# EAGLE schematic u4xVCA_v3 (EAGLE 9.2.1)

## Sheet 1 of 5
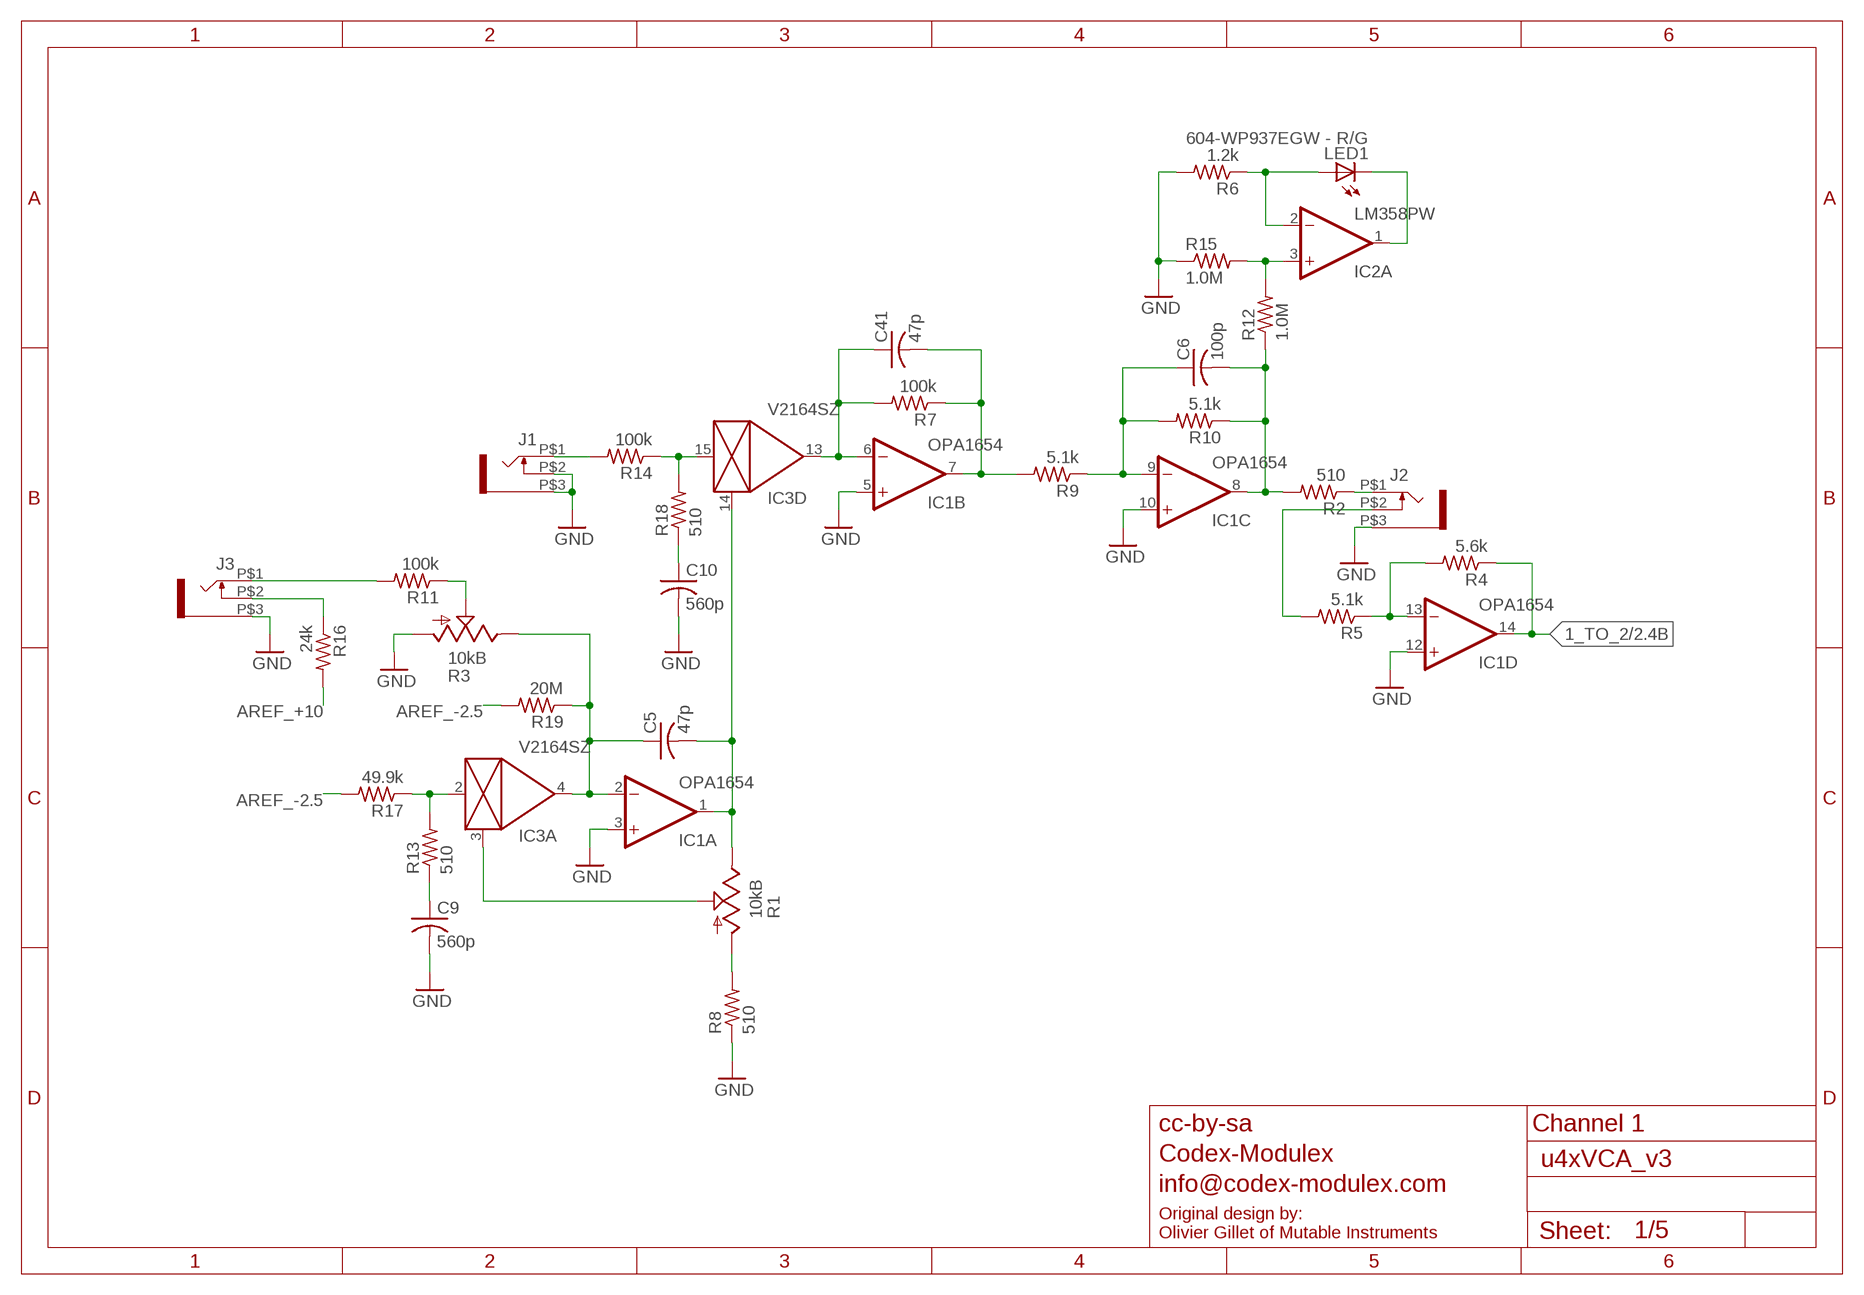
[diagram p0: schematic, sheet 1]

### Parts
C5  47p  C-USC0603  [C0603]
C6  100p  C-USC0603  [C0603]
C9  560p  C-USC0603  [C0603]
C10  560p  C-USC0603  [C0603]
C41  47p  C-USC0603  [C0603]
IC1  OPA1654  TL074PW  [TSSOP14]
IC2  LM358PW  TL072PW  [TSSOP8]
IC3  V2164SZ  SSM2164S  [SOIC16N]
J1  WQP-PJ301M-12_JACK  [WQP-PJ301M-12_JACK]
J2  WQP-PJ301M-12_JACK  [WQP-PJ301M-12_JACK]
J3  WQP-PJ301M-12_JACK  [WQP-PJ301M-12_JACK]
LED1  604-WP937EGW - R/G  LED3MM  [LED3MM]
R1  10kB  POT_USVERTICAL  [ALPS_POT_VERTICAL]
R2  510  PARTS_AMAN_RESISTOR  [PARTS_AMAN_RESISTOR_0603]
R3  10kB  POT_USVERTICAL  [ALPS_POT_VERTICAL]
R4  5.6k  PARTS_AMAN_RESISTOR  [PARTS_AMAN_RESISTOR_0603]
R5  5.1k  PARTS_AMAN_RESISTOR  [PARTS_AMAN_RESISTOR_0603]
R6  1.2k  PARTS_AMAN_RESISTOR  [PARTS_AMAN_RESISTOR_0603]
R7  100k  PARTS_AMAN_RESISTOR  [PARTS_AMAN_RESISTOR_0603]
R8  510  R-US_R0603  [R0603]
R9  5.1k  PARTS_AMAN_RESISTOR  [PARTS_AMAN_RESISTOR_0603]
R10  5.1k  PARTS_AMAN_RESISTOR  [PARTS_AMAN_RESISTOR_0603]
R11  100k  PARTS_AMAN_RESISTOR  [PARTS_AMAN_RESISTOR_0603]
R12  1.0M  PARTS_AMAN_RESISTOR  [PARTS_AMAN_RESISTOR_0603]
R13  510  PARTS_AMAN_RESISTOR  [PARTS_AMAN_RESISTOR_0603]
R14  100k  PARTS_AMAN_RESISTOR  [PARTS_AMAN_RESISTOR_0603]
R15  1.0M  PARTS_AMAN_RESISTOR  [PARTS_AMAN_RESISTOR_0603]
R16  24k  PARTS_AMAN_RESISTOR  [PARTS_AMAN_RESISTOR_0603]
R17  49.9k  PARTS_AMAN_RESISTOR  [PARTS_AMAN_RESISTOR_0603]
R18  510  PARTS_AMAN_RESISTOR  [PARTS_AMAN_RESISTOR_0603]
R19  20M  PARTS_AMAN_RESISTOR  [PARTS_AMAN_RESISTOR_0603]

### Nets
1_TO_2: IC1.14(D:OUT) R4.1 ; also sheet 2
AREF_+10: R16.2 ; also sheet 2,3,4,5
AREF_-2.5: R17.2 R19.2 ; also sheet 2,3,4,5
CV_IN_1: J3.P$1 R11.2
FOO: IC3.2(A:IN) R13.2 R17.1
GND: C9.2 C10.2 IC1.3(A:+IN) IC1.5(B:+IN) IC1.10(C:+IN) IC1.12(D:+IN) J1.P$2 J1.P$3 J2.P$3 J3.P$3 R3.P$3(A) R6.2 R8.1 R15.1 ; also sheet 2,3,4,5
N$1: IC2.3(A:+IN) R12.2 R15.2
N$7: J2.P$1 R2.1
N$9: IC3.3(A:CTRL) R1.P$2(S)
N$10: C6.1 IC1.9(C:-IN) R9.1 R10.2
N$14: R3.P$2(S) R11.1
N$15: R1.P$3(A) R8.2
N$18: IC2.1(A:OUT) LED1.K(C)
N$19: IC2.2(A:-IN) LED1.A R6.1
N$20: C9.1 R13.1
N$21: J3.P$2 R16.1
N$22: IC1.13(D:-IN) R4.2 R5.1
N$25: J2.P$2 R5.2
N$47: C10.1 R18.1
N$65: C5.1 IC1.2(A:-IN) IC3.4(A:OUT) R3.P$1(E) R19.1
N$66: J1.P$1 R14.2
N$75: IC3.15(D:IN) R14.1 R18.2
N$87: C5.2 IC1.1(A:OUT) IC3.14(D:CTRL) R1.P$1(E)
N$96: C41.1 IC1.6(B:-IN) IC3.13(D:OUT) R7.2
N$100: C41.2 IC1.7(B:OUT) R7.1 R9.2
OUT1: C6.2 IC1.8(C:OUT) R2.2 R10.1 R12.1

### Notes on the sheet
- cc-by-sa | Channel 1
- Codex-Modulex
- info@codex-modulex.com
- Original design by:
  Olivier Gillet of Mutable Instruments

## Sheet 2 of 5
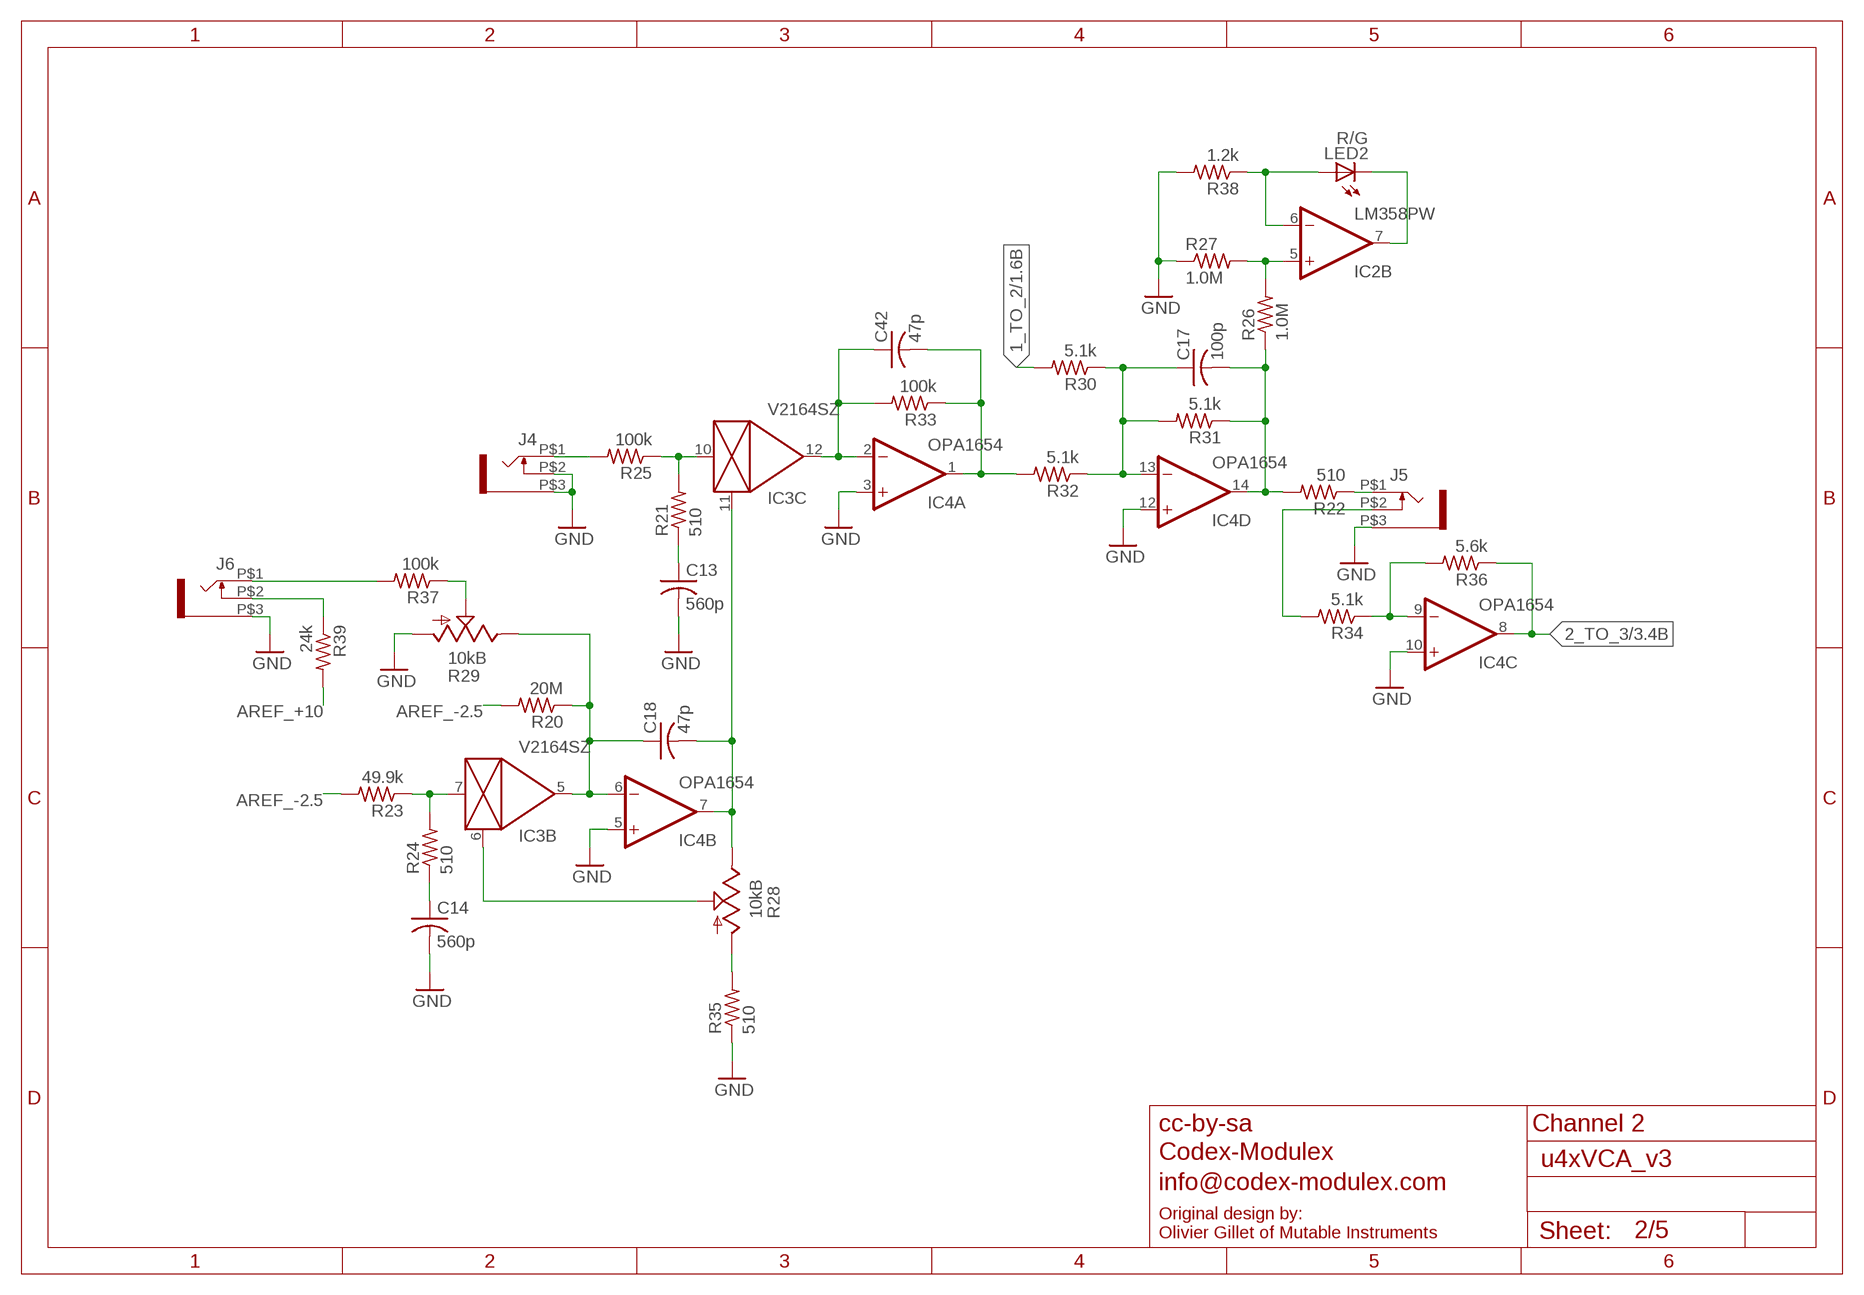
[diagram p1: schematic, sheet 2]

### Parts
C13  560p  C-USC0603  [C0603]
C14  560p  C-USC0603  [C0603]
C17  100p  C-USC0603  [C0603]
C18  47p  C-USC0603  [C0603]
C42  47p  C-USC0603  [C0603]
IC4  OPA1654  TL074PW  [TSSOP14]
J4  WQP-PJ301M-12_JACK  [WQP-PJ301M-12_JACK]
J5  WQP-PJ301M-12_JACK  [WQP-PJ301M-12_JACK]
J6  WQP-PJ301M-12_JACK  [WQP-PJ301M-12_JACK]
LED2  R/G  LED3MM  [LED3MM]
R20  20M  PARTS_AMAN_RESISTOR  [PARTS_AMAN_RESISTOR_0603]
R21  510  PARTS_AMAN_RESISTOR  [PARTS_AMAN_RESISTOR_0603]
R22  510  R-US_R0603  [R0603]
R23  49.9k  PARTS_AMAN_RESISTOR  [PARTS_AMAN_RESISTOR_0603]
R24  510  PARTS_AMAN_RESISTOR  [PARTS_AMAN_RESISTOR_0603]
R25  100k  PARTS_AMAN_RESISTOR  [PARTS_AMAN_RESISTOR_0603]
R26  1.0M  PARTS_AMAN_RESISTOR  [PARTS_AMAN_RESISTOR_0603]
R27  1.0M  PARTS_AMAN_RESISTOR  [PARTS_AMAN_RESISTOR_0603]
R28  10kB  POT_USVERTICAL  [ALPS_POT_VERTICAL]
R29  10kB  POT_USVERTICAL  [ALPS_POT_VERTICAL]
R30  5.1k  PARTS_AMAN_RESISTOR  [PARTS_AMAN_RESISTOR_0603]
R31  5.1k  PARTS_AMAN_RESISTOR  [PARTS_AMAN_RESISTOR_0603]
R32  5.1k  PARTS_AMAN_RESISTOR  [PARTS_AMAN_RESISTOR_0603]
R33  100k  PARTS_AMAN_RESISTOR  [PARTS_AMAN_RESISTOR_0603]
R34  5.1k  PARTS_AMAN_RESISTOR  [PARTS_AMAN_RESISTOR_0603]
R35  510  R-US_R0603  [R0603]
R36  5.6k  PARTS_AMAN_RESISTOR  [PARTS_AMAN_RESISTOR_0603]
R37  100k  PARTS_AMAN_RESISTOR  [PARTS_AMAN_RESISTOR_0603]
R38  1.2k  PARTS_AMAN_RESISTOR  [PARTS_AMAN_RESISTOR_0603]
R39  24k  PARTS_AMAN_RESISTOR  [PARTS_AMAN_RESISTOR_0603]

### Nets
1_TO_2: R30.2 ; also sheet 1
2_TO_3: IC4.8(C:OUT) R36.1 ; also sheet 3
AREF_+10: R39.2 ; also sheet 1,3,4,5
AREF_-2.5: R20.2 R23.2 ; also sheet 1,3,4,5
FOO1: IC3.7(B:IN) R23.1 R24.2
GND: C13.2 C14.2 IC4.3(A:+IN) IC4.5(B:+IN) IC4.10(C:+IN) IC4.12(D:+IN) J4.P$2 J4.P$3 J5.P$3 J6.P$3 R27.1 R29.P$3(A) R35.1 R38.2 ; also sheet 1,3,4,5
N$3: J4.P$1 R25.2
N$4: IC2.5(B:+IN) R26.2 R27.2
N$6: J5.P$1 R22.1
N$17: C13.1 R21.1
N$24: IC3.10(C:IN) R21.2 R25.1
N$26: IC3.6(B:CTRL) R28.P$2(S)
N$27: C17.1 IC4.13(D:-IN) R30.1 R31.2 R32.1
N$28: C18.2 IC3.11(C:CTRL) IC4.7(B:OUT) R28.P$1(E)
N$32: R28.P$3(A) R35.2
N$35: IC2.7(B:OUT) LED2.K(C)
N$36: IC2.6(B:-IN) LED2.A R38.1
N$37: IC4.9(C:-IN) R34.1 R36.2
N$38: J5.P$2 R34.2
N$39: C42.2 IC4.1(A:OUT) R32.2 R33.1
N$40: R29.P$2(S) R37.1
N$41: C14.1 R24.1
N$42: C18.1 IC3.5(B:OUT) IC4.6(B:-IN) R20.1 R29.P$1(E)
N$44: J6.P$1 R37.2
N$53: C42.1 IC3.12(C:OUT) IC4.2(A:-IN) R33.2
N$64: J6.P$2 R39.1
OUT2: C17.2 IC4.14(D:OUT) R22.2 R26.1 R31.1

### Notes on the sheet
- cc-by-sa | Channel 2
- Codex-Modulex
- info@codex-modulex.com
- Original design by:
  Olivier Gillet of Mutable Instruments

## Sheet 3 of 5
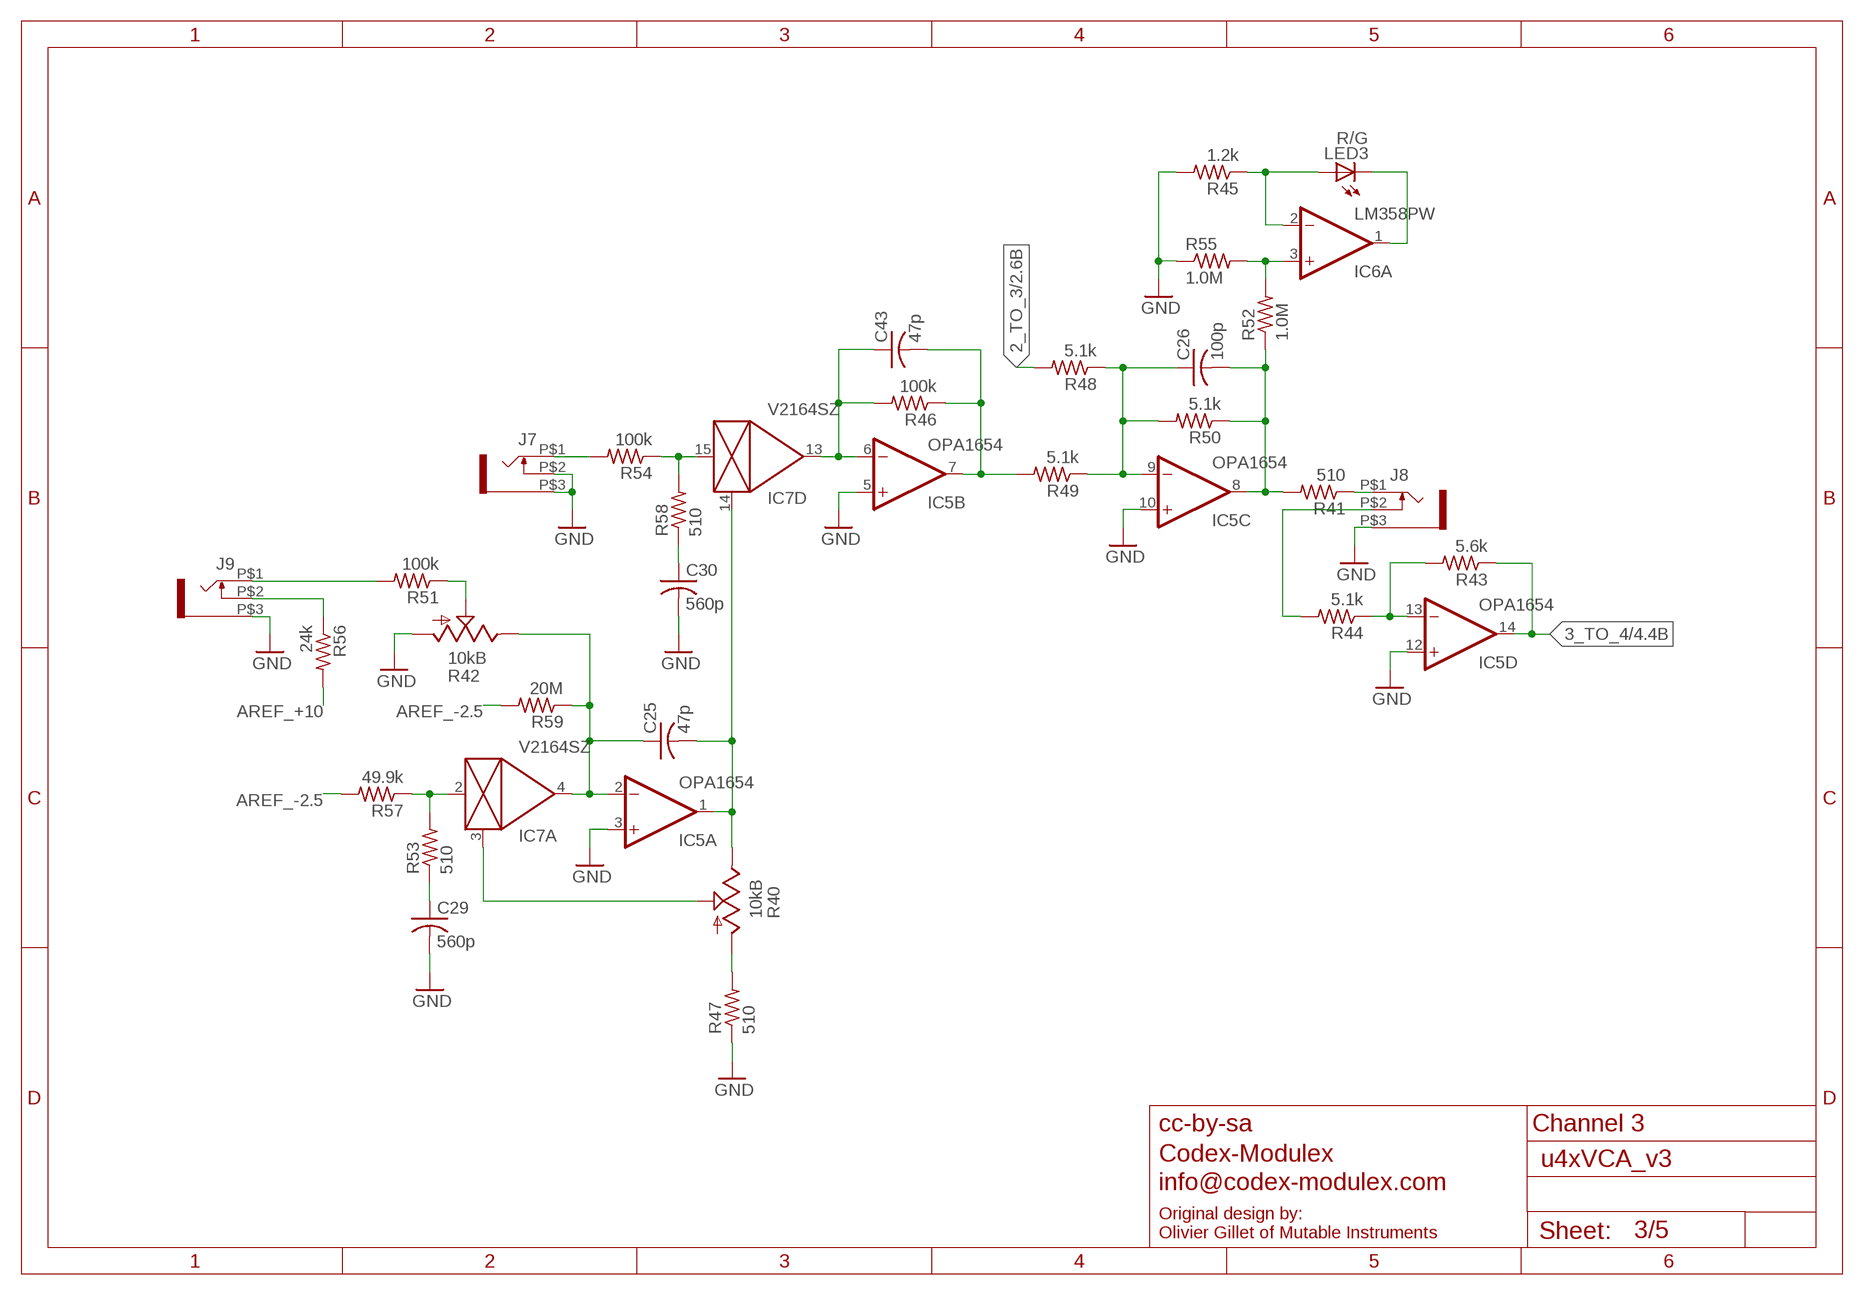
[diagram p2: schematic, sheet 3]

### Parts
C25  47p  C-USC0603  [C0603]
C26  100p  C-USC0603  [C0603]
C29  560p  C-USC0603  [C0603]
C30  560p  C-USC0603  [C0603]
C43  47p  C-USC0603  [C0603]
IC5  OPA1654  TL074PW  [TSSOP14]
IC6  LM358PW  TL072PW  [TSSOP8]
IC7  V2164SZ  SSM2164S  [SOIC16N]
J7  WQP-PJ301M-12_JACK  [WQP-PJ301M-12_JACK]
J8  WQP-PJ301M-12_JACK  [WQP-PJ301M-12_JACK]
J9  WQP-PJ301M-12_JACK  [WQP-PJ301M-12_JACK]
LED3  R/G  LED3MM  [LED3MM]
R40  10kB  POT_USVERTICAL  [ALPS_POT_VERTICAL]
R41  510  PARTS_AMAN_RESISTOR  [PARTS_AMAN_RESISTOR_0603]
R42  10kB  POT_USVERTICAL  [ALPS_POT_VERTICAL]
R43  5.6k  PARTS_AMAN_RESISTOR  [PARTS_AMAN_RESISTOR_0603]
R44  5.1k  PARTS_AMAN_RESISTOR  [PARTS_AMAN_RESISTOR_0603]
R45  1.2k  PARTS_AMAN_RESISTOR  [PARTS_AMAN_RESISTOR_0603]
R46  100k  PARTS_AMAN_RESISTOR  [PARTS_AMAN_RESISTOR_0603]
R47  510  PARTS_AMAN_RESISTOR  [PARTS_AMAN_RESISTOR_0603]
R48  5.1k  PARTS_AMAN_RESISTOR  [PARTS_AMAN_RESISTOR_0603]
R49  5.1k  PARTS_AMAN_RESISTOR  [PARTS_AMAN_RESISTOR_0603]
R50  5.1k  PARTS_AMAN_RESISTOR  [PARTS_AMAN_RESISTOR_0603]
R51  100k  PARTS_AMAN_RESISTOR  [PARTS_AMAN_RESISTOR_0603]
R52  1.0M  PARTS_AMAN_RESISTOR  [PARTS_AMAN_RESISTOR_0603]
R53  510  PARTS_AMAN_RESISTOR  [PARTS_AMAN_RESISTOR_0603]
R54  100k  PARTS_AMAN_RESISTOR  [PARTS_AMAN_RESISTOR_0603]
R55  1.0M  PARTS_AMAN_RESISTOR  [PARTS_AMAN_RESISTOR_0603]
R56  24k  PARTS_AMAN_RESISTOR  [PARTS_AMAN_RESISTOR_0603]
R57  49.9k  PARTS_AMAN_RESISTOR  [PARTS_AMAN_RESISTOR_0603]
R58  510  PARTS_AMAN_RESISTOR  [PARTS_AMAN_RESISTOR_0603]
R59  20M  PARTS_AMAN_RESISTOR  [PARTS_AMAN_RESISTOR_0603]

### Nets
2_TO_3: R48.2 ; also sheet 2
3_TO_4: IC5.14(D:OUT) R43.1 ; also sheet 4
AREF_+10: R56.2 ; also sheet 1,2,4,5
AREF_-2.5: R57.2 R59.2 ; also sheet 1,2,4,5
FOO2: IC7.2(A:IN) R53.2 R57.1
GND: C29.2 C30.2 IC5.3(A:+IN) IC5.5(B:+IN) IC5.10(C:+IN) IC5.12(D:+IN) J7.P$2 J7.P$3 J8.P$3 J9.P$3 R42.P$3(A) R45.2 R47.1 R55.1 ; also sheet 1,2,4,5
N$5: IC6.3(A:+IN) R52.2 R55.2
N$23: J8.P$1 R41.1
N$29: IC7.3(A:CTRL) R40.P$2(S)
N$30: C25.2 IC5.1(A:OUT) IC7.14(D:CTRL) R40.P$1(E)
N$34: R40.P$3(A) R47.2
N$45: C30.1 R58.1
N$46: IC7.15(D:IN) R54.1 R58.2
N$49: C26.1 IC5.9(C:-IN) R48.1 R49.1 R50.2
N$50: J9.P$2 R56.1
N$52: J7.P$1 R54.2
N$55: J9.P$1 R51.2
N$56: C43.1 IC5.6(B:-IN) IC7.13(D:OUT) R46.2
N$58: IC6.1(A:OUT) LED3.K(C)
N$59: IC6.2(A:-IN) LED3.A R45.1
N$60: IC5.13(D:-IN) R43.2 R44.1
N$61: J8.P$2 R44.2
N$63: C29.1 R53.1
N$67: C25.1 IC5.2(A:-IN) IC7.4(A:OUT) R42.P$1(E) R59.1
N$70: R42.P$2(S) R51.1
N$103: C43.2 IC5.7(B:OUT) R46.1 R49.2
OUT3: C26.2 IC5.8(C:OUT) R41.2 R50.1 R52.1

### Notes on the sheet
- cc-by-sa | Channel 3
- Codex-Modulex
- info@codex-modulex.com
- Original design by:
  Olivier Gillet of Mutable Instruments

## Sheet 4 of 5
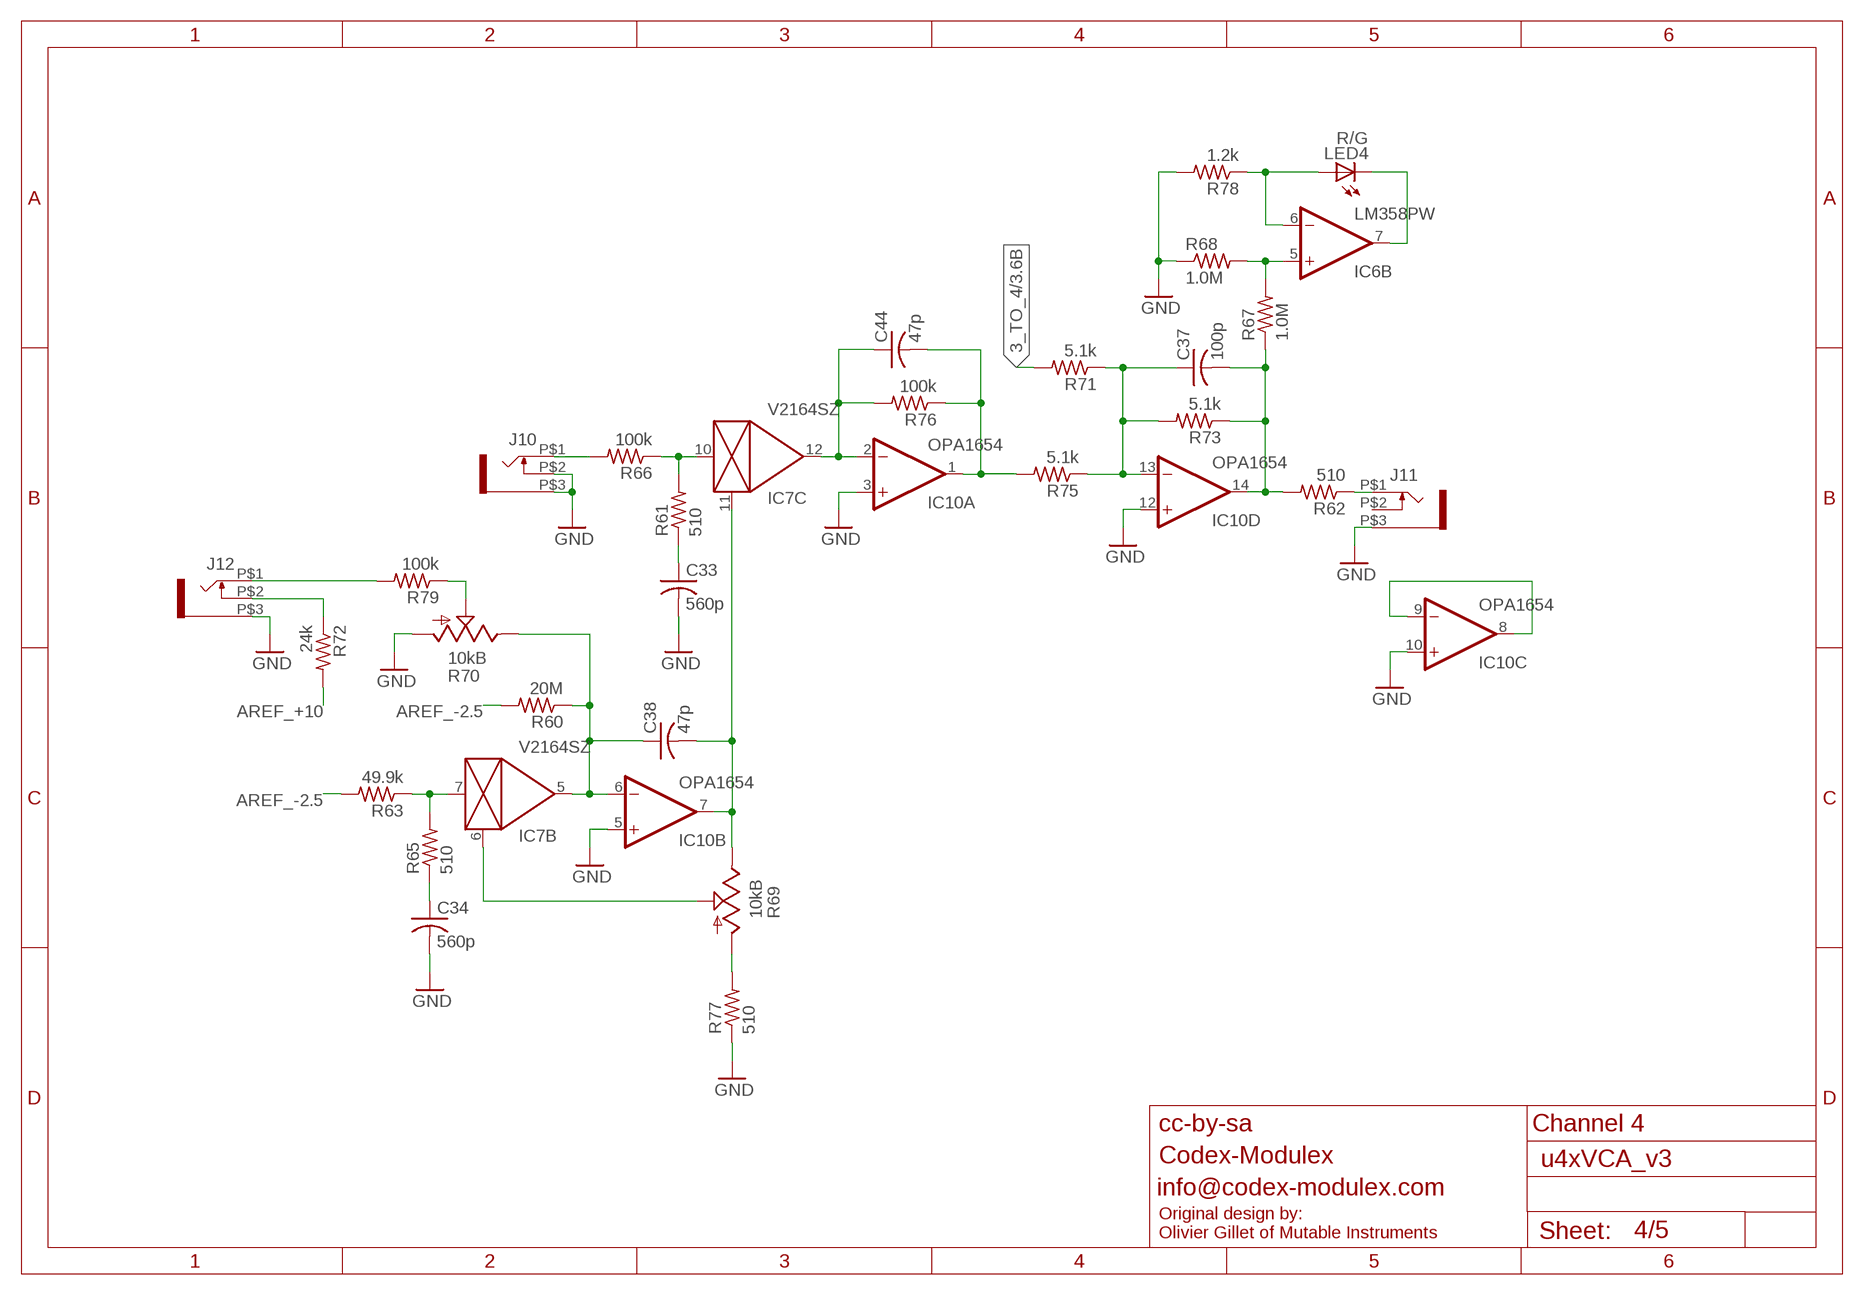
[diagram p3: schematic, sheet 4]

### Parts
C33  560p  C-USC0603  [C0603]
C34  560p  C-USC0603  [C0603]
C37  100p  C-USC0603  [C0603]
C38  47p  C-USC0603  [C0603]
C44  47p  C-USC0603  [C0603]
IC10  OPA1654  TL074PW  [TSSOP14]
J10  WQP-PJ301M-12_JACK  [WQP-PJ301M-12_JACK]
J11  WQP-PJ301M-12_JACK  [WQP-PJ301M-12_JACK]
J12  WQP-PJ301M-12_JACK  [WQP-PJ301M-12_JACK]
LED4  R/G  LED3MM  [LED3MM]
R60  20M  PARTS_AMAN_RESISTOR  [PARTS_AMAN_RESISTOR_0603]
R61  510  PARTS_AMAN_RESISTOR  [PARTS_AMAN_RESISTOR_0603]
R62  510  PARTS_AMAN_RESISTOR  [PARTS_AMAN_RESISTOR_0603]
R63  49.9k  PARTS_AMAN_RESISTOR  [PARTS_AMAN_RESISTOR_0603]
R65  510  PARTS_AMAN_RESISTOR  [PARTS_AMAN_RESISTOR_0603]
R66  100k  PARTS_AMAN_RESISTOR  [PARTS_AMAN_RESISTOR_0603]
R67  1.0M  PARTS_AMAN_RESISTOR  [PARTS_AMAN_RESISTOR_0603]
R68  1.0M  PARTS_AMAN_RESISTOR  [PARTS_AMAN_RESISTOR_0603]
R69  10kB  POT_USVERTICAL  [ALPS_POT_VERTICAL]
R70  10kB  POT_USVERTICAL  [ALPS_POT_VERTICAL]
R71  5.1k  PARTS_AMAN_RESISTOR  [PARTS_AMAN_RESISTOR_0603]
R72  24k  PARTS_AMAN_RESISTOR  [PARTS_AMAN_RESISTOR_0603]
R73  5.1k  PARTS_AMAN_RESISTOR  [PARTS_AMAN_RESISTOR_0603]
R75  5.1k  PARTS_AMAN_RESISTOR  [PARTS_AMAN_RESISTOR_0603]
R76  100k  PARTS_AMAN_RESISTOR  [PARTS_AMAN_RESISTOR_0603]
R77  510  PARTS_AMAN_RESISTOR  [PARTS_AMAN_RESISTOR_0603]
R78  1.2k  PARTS_AMAN_RESISTOR  [PARTS_AMAN_RESISTOR_0603]
R79  100k  PARTS_AMAN_RESISTOR  [PARTS_AMAN_RESISTOR_0603]

### Nets
3_TO_4: R71.2 ; also sheet 3
AREF_+10: R72.2 ; also sheet 1,2,3,5
AREF_-2.5: R60.2 R63.2 ; also sheet 1,2,3,5
FOO3: IC7.7(B:IN) R63.1 R65.2
GND: C33.2 C34.2 IC10.3(A:+IN) IC10.5(B:+IN) IC10.10(C:+IN) IC10.12(D:+IN) J10.P$2 J10.P$3 J11.P$3 J12.P$3 R68.1 R70.P$3(A) R77.1 R78.2 ; also sheet 1,2,3,5
N$2: IC10.8(C:OUT) IC10.9(C:-IN)
N$8: IC6.5(B:+IN) R67.2 R68.2
N$33: C38.2 IC7.11(C:CTRL) IC10.7(B:OUT) R69.P$1(E)
N$43: IC7.6(B:CTRL) R69.P$2(S)
N$51: R69.P$3(A) R77.2
N$62: C44.1 IC7.12(C:OUT) IC10.2(A:-IN) R76.2
N$69: J10.P$1 R66.2
N$71: J11.P$1 R62.1
N$72: C33.1 R61.1
N$73: IC7.10(C:IN) R61.2 R66.1
N$76: C37.1 IC10.13(D:-IN) R71.1 R73.2 R75.1
N$77: J12.P$1 R79.2
N$84: IC6.7(B:OUT) LED4.K(C)
N$85: IC6.6(B:-IN) LED4.A R78.1
N$88: C44.2 IC10.1(A:OUT) R75.2 R76.1
N$89: R70.P$2(S) R79.1
N$90: C34.1 R65.1
N$91: C38.1 IC7.5(B:OUT) IC10.6(B:-IN) R60.1 R70.P$1(E)
N$105: J12.P$2 R72.1
OUT4: C37.2 IC10.14(D:OUT) R62.2 R67.1 R73.1
Unconnected: J11.P$2

### Notes on the sheet
- cc-by-sa | Channel 4
- Codex-Modulex
- info@codex-modulex.com
- Original design by:
  Olivier Gillet of Mutable Instruments

## Sheet 5 of 5
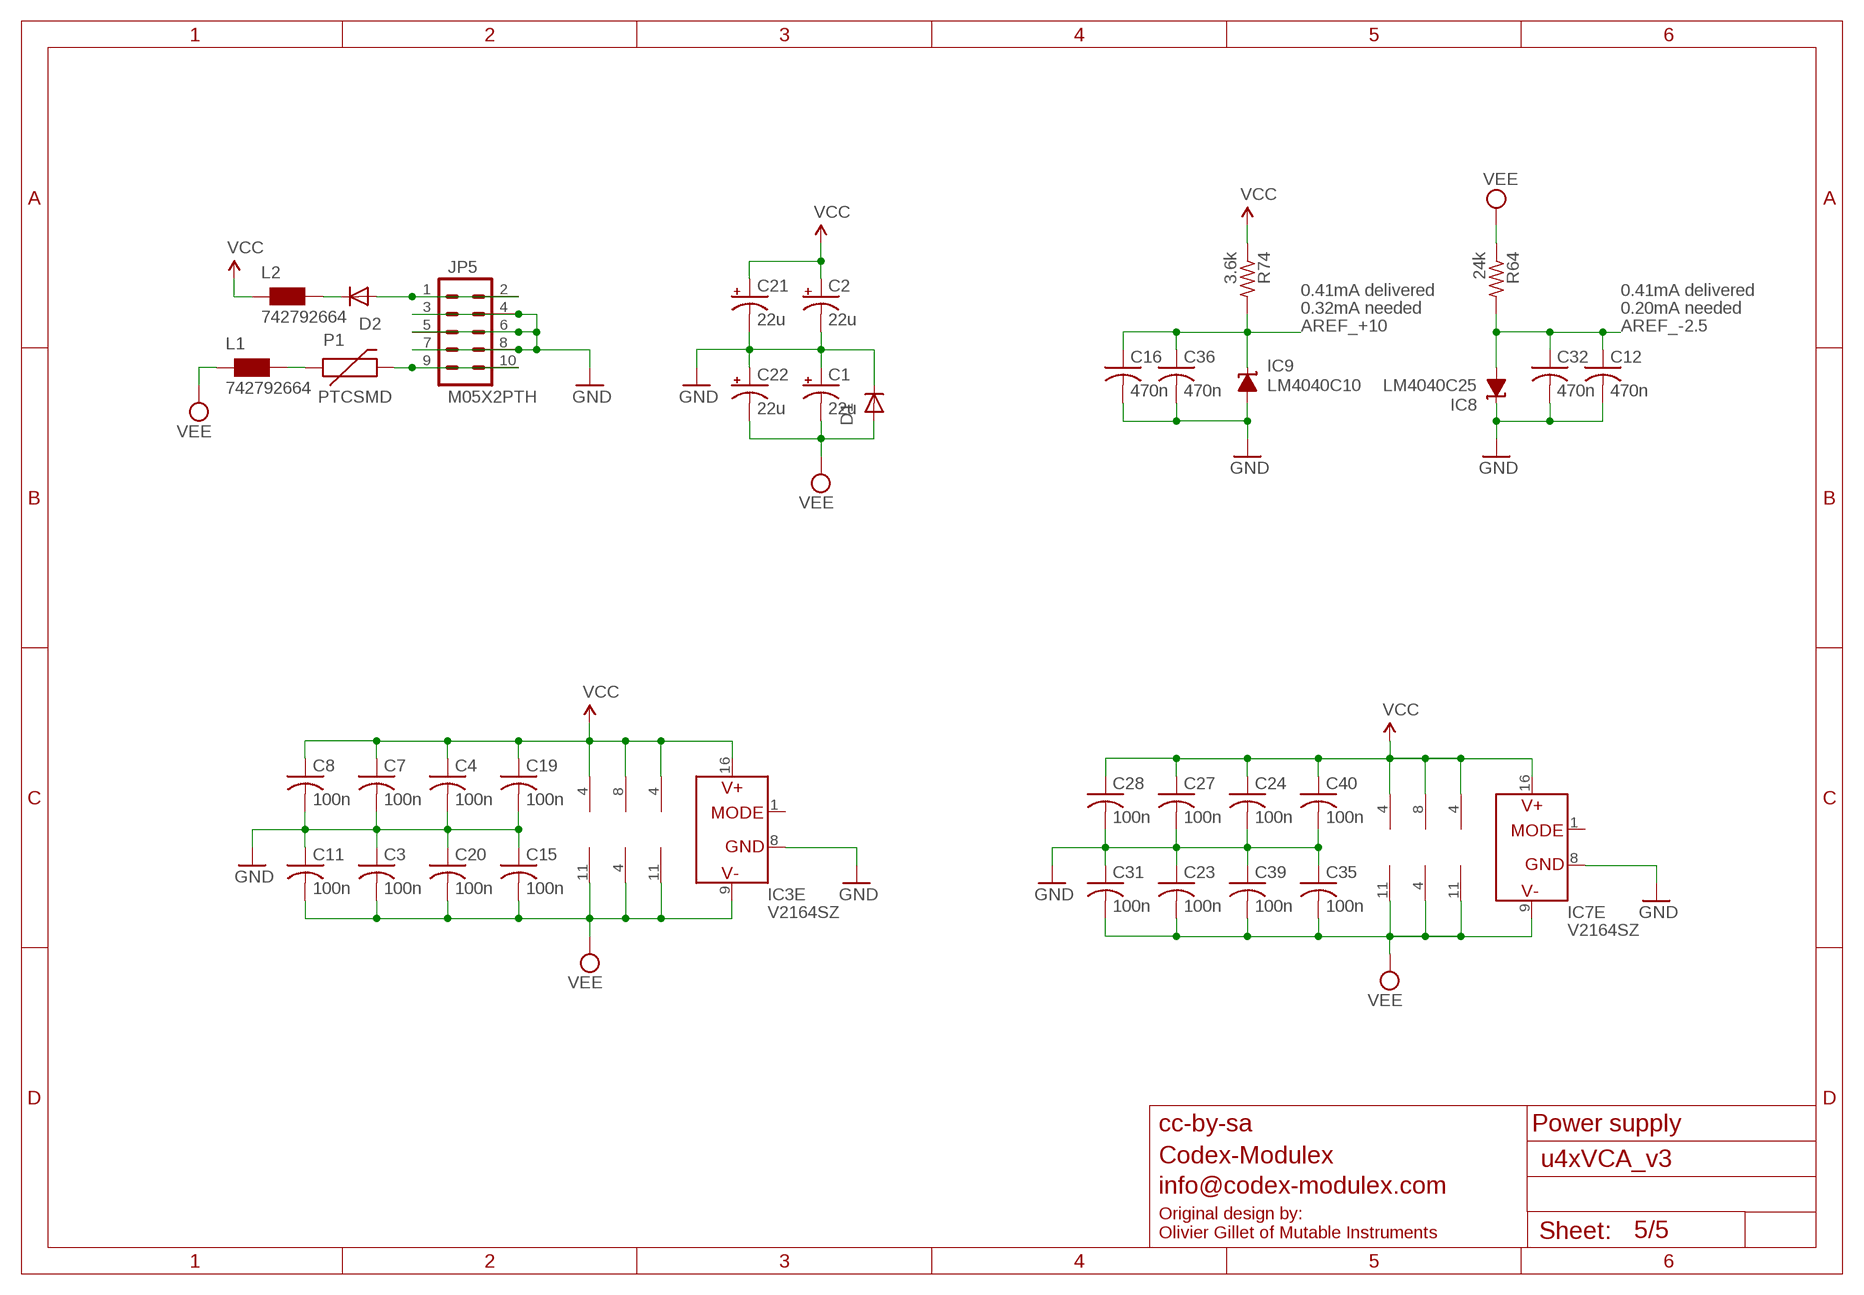
[diagram p4: schematic, sheet 5]

### Parts
C1  22u  CPOL-USB  [PANASONIC_B]
C2  22u  CPOL-USB  [PANASONIC_B]
C3  100n  C-USC0603  [C0603]
C4  100n  C-USC0603  [C0603]
C7  100n  C-USC0603  [C0603]
C8  100n  C-USC0603  [C0603]
C11  100n  C-USC0603  [C0603]
C12  470n  C-USC0603  [C0603]
C15  100n  C-USC0603  [C0603]
C16  470n  C-USC0603  [C0603]
C19  100n  C-USC0603  [C0603]
C20  100n  C-USC0603  [C0603]
C21  22u  CPOL-USB  [PANASONIC_B]
C22  22u  CPOL-USB  [PANASONIC_B]
C23  100n  C-USC0603  [C0603]
C24  100n  C-USC0603  [C0603]
C27  100n  C-USC0603  [C0603]
C28  100n  C-USC0603  [C0603]
C31  100n  C-USC0603  [C0603]
C32  470n  C-USC0603  [C0603]
C35  100n  C-USC0603  [C0603]
C36  470n  C-USC0603  [C0603]
C39  100n  C-USC0603  [C0603]
C40  100n  C-USC0603  [C0603]
D1  1N5819HW  DIODE-SOD123  [SOD123]
D2  1N5819HW  DIODE-SOD123  [SOD123]
IC8  LM4040C25  LM4041B12DBZ  [DBZ_R-PDSO-G3]
IC9  LM4040C10  LM4041B12DBZ  [DBZ_R-PDSO-G3]
JP5  M05X2PTH  [AVR_ICSP]
L1  742792664  WE-CBF_0603  [0603]
L2  742792664  WE-CBF_0603  [0603]
P1  PTCSMD  [PTC-1206]
R64  24k  PARTS_AMAN_RESISTOR  [PARTS_AMAN_RESISTOR_0603]
R74  3.6k  PARTS_AMAN_RESISTOR  [PARTS_AMAN_RESISTOR_0603]

### Nets
AREF_+10: C16.1 C36.1 IC9.1(C) R74.2 ; also sheet 1,2,3,4
AREF_-2.5: C12.1 C32.1 IC8.2(A) R64.2 ; also sheet 1,2,3,4
GND: C1.+ C2.- C3.1 C4.2 C7.2 C8.2 C11.1 C12.2 C15.1 C16.2 C19.2 C20.1 C21.- C22.+ C23.1 C24.2 C27.2 C28.2 C31.1 C32.2 C35.1 C36.2 C39.1 C40.2 D1.C IC3.8(E:GND) IC7.8(E:GND) IC8.1(C) IC9.2(A) JP5.3 JP5.4 JP5.5 JP5.6 JP5.7 JP5.8 ; also sheet 1,2,3,4
N$11: D2.A JP5.1 JP5.2
N$12: JP5.9 JP5.10 P1.2
N$13: L1.2 P1.1
N$16: D2.C L2.2
VCC: C2.+ C4.1 C7.1 C8.1 C19.1 C21.+ C24.1 C27.1 C28.1 C40.1 IC1.4(P:V+) IC2.8(P:V+) IC3.16(E:V+) IC4.4(P:V+) IC5.4(P:V+) IC6.8(P:V+) IC7.16(E:V+) IC10.4(P:V+) L2.1 R74.1
VEE: C1.- C3.2 C11.2 C15.2 C20.2 C22.- C23.2 C31.2 C35.2 C39.2 D1.A IC1.11(P:V-) IC2.4(P:V-) IC3.9(E:V-) IC4.11(P:V-) IC5.11(P:V-) IC6.4(P:V-) IC7.9(E:V-) IC10.11(P:V-) L1.1 R64.1
Unconnected: IC3.1(E:MODE) IC7.1(E:MODE)

### Notes on the sheet
- 0.41mA delivered | 0.41mA delivered
- 0.32mA needed | 0.20mA needed
- cc-by-sa | Power supply
- Codex-Modulex
- info@codex-modulex.com
- Original design by:
  Olivier Gillet of Mutable Instruments

## Library data of the parts
C1 C2 C21 C22 = rcl:CPOL-US: POLARIZED CAPACITOR, American symbol
C3-C20 C23-C44 = resistor:C-US: CAPACITOR, American symbol
D1 D2 = diode:DIODE-: DIODE
IC1 IC4 IC5 IC10 = linear:TL074: OP AMP
IC2 IC6 = linear:TL072: OP AMP
IC3 IC7 = ssm2164:SSM2164
IC8 IC9 = texas:LM4041: PRECISION MICROPOWER SHUNT VOLTAGE REFERENCE Source: http://focus.ti.com/lit/ds/slcs146e/slcs146e.pdf
J1-J12 = thonkiconn:WQP-PJ301M-12_JACK
JP5 = og-header:M05X2: Header 5x2 Standard 10-pin dual row 0.1" header. Commonly used with AVR-ISP. Use with Spark Fun Electronics SKU: PRT-00778
L1 L2 = wuerth-elektronik:WE-CBF: SMD EMI Suppression Ferrite Beads - excellent anti-EMI properties - low DCR - impedances till 3000 ohms - rated current up to 6 A
LED1-LED4 = led:LED: LED OSRAM: - CHIPLED LG R971, LG N971, LY N971, LG Q971, LY Q971, LO R971, LY R971 LH N974, LH R974 LS Q976, LO Q976, LY Q976 LO Q996 - Hyper CHIPLED LW Q18S LB Q993, LB Q99A, LB R99A - SideLED LS A670, LO A670, LY A670, LG A670, LP A670 LB A673, LV A673, LT A673, LW A673 LH A674 LY A675 LS A676, LA A676, LO A676, LY A676, LW A676 LS A679, LY A679, LG A679 - Hyper Micro SIDELED® LS Y876, LA Y876, LO Y876, LY Y876 LT Y87S - SmartLED LW L88C, LW L88S LB L89C, LB L89S, LG L890 LS L89K, LO L89K, LY L89K LS L896, LA L896, LO L896, LY L896 - TOPLED LS T670, LO T670, LY T670, LG T670, LP T670 LSG T670, LSP T670, LSY T670, LOP T670, LYG T670 LG T671, LOG T671, LSG T671 LB T673, LV T673, LT T673, LW T673 LH T674 LS T676, LA T676, LO T676, LY T676, LB T676, LH T676, LSB T676, LW T676 LB T67C, LV T67C, LT T67C, LS T67K, LO T67K, LY T67K, LW E67C LS E67B, LA E67B, LO E67B, LY E67B, LB E67C, LV E67C, LT E67C LW T67C LS T679, LY T679, LG T679 LS T770, LO T770, LY T770, LG T770, LP T770 LB T773, LV T773, LT T773, LW T773 LH T774 LS E675, LA E675, LY E675, LS T675 LS T776, LA T776, LO T776, LY T776, LB T776 LHGB T686 LT T68C, LB T68C - Hyper Mini TOPLED® LB M676 - Mini TOPLED Santana® LG M470 LS M47K, LO M47K, LY M47K Source: http://www.osram.convergy.de LUXEON: - LUMILED® LXK2-PW12-R00, LXK2-PW12-S00, LXK2-PW14-U00, LXK2-PW14-V00 LXK2-PM12-R00, LXK2-PM12-S00, LXK2-PM14-U00 LXK2-PE12-Q00, LXK2-PE12-R00, LXK2-PE12-S00, LXK2-PE14-T00, LXK2-PE14-U00 LXK2-PB12-K00, LXK2-PB12-L00, LXK2-PB12-M00, LXK2-PB14-N00, LXK2-PB14-P00, LXK2-PB14-Q00 LXK2-PR12-L00, LXK2-PR12-M00, LXK2-PR14-Q00, LXK2-PR14-R00 LXK2-PD12-Q00, LXK2-PD12-R00, LXK2-PD12-S00 LXK2-PH12-R00, LXK2-PH12-S00 LXK2-PL12-P00, LXK2-PL12-Q00, LXK2-PL12-R00 Source: www.luxeon.com KINGBRIGHT: KA-3528ASYC Source: www.kingbright.com
P1 = SparkFun:PTC: Resettable Fuse PTC Resettable Fuse. Spark Fun Electronics SKU : COM-08357
R1 R3 R28 R29 R40 R42 R69 R70 = og-pots:POT_US
R2 R4-R7 R9-R21 R23-R27 R30-R34 R36-R39 R41 R43-R68 R71-R79 = atom_v1_1_board_2:PARTS_AMAN_RESISTOR
R8 R22 R35 = resistor:R-US_: RESISTOR, American symbol